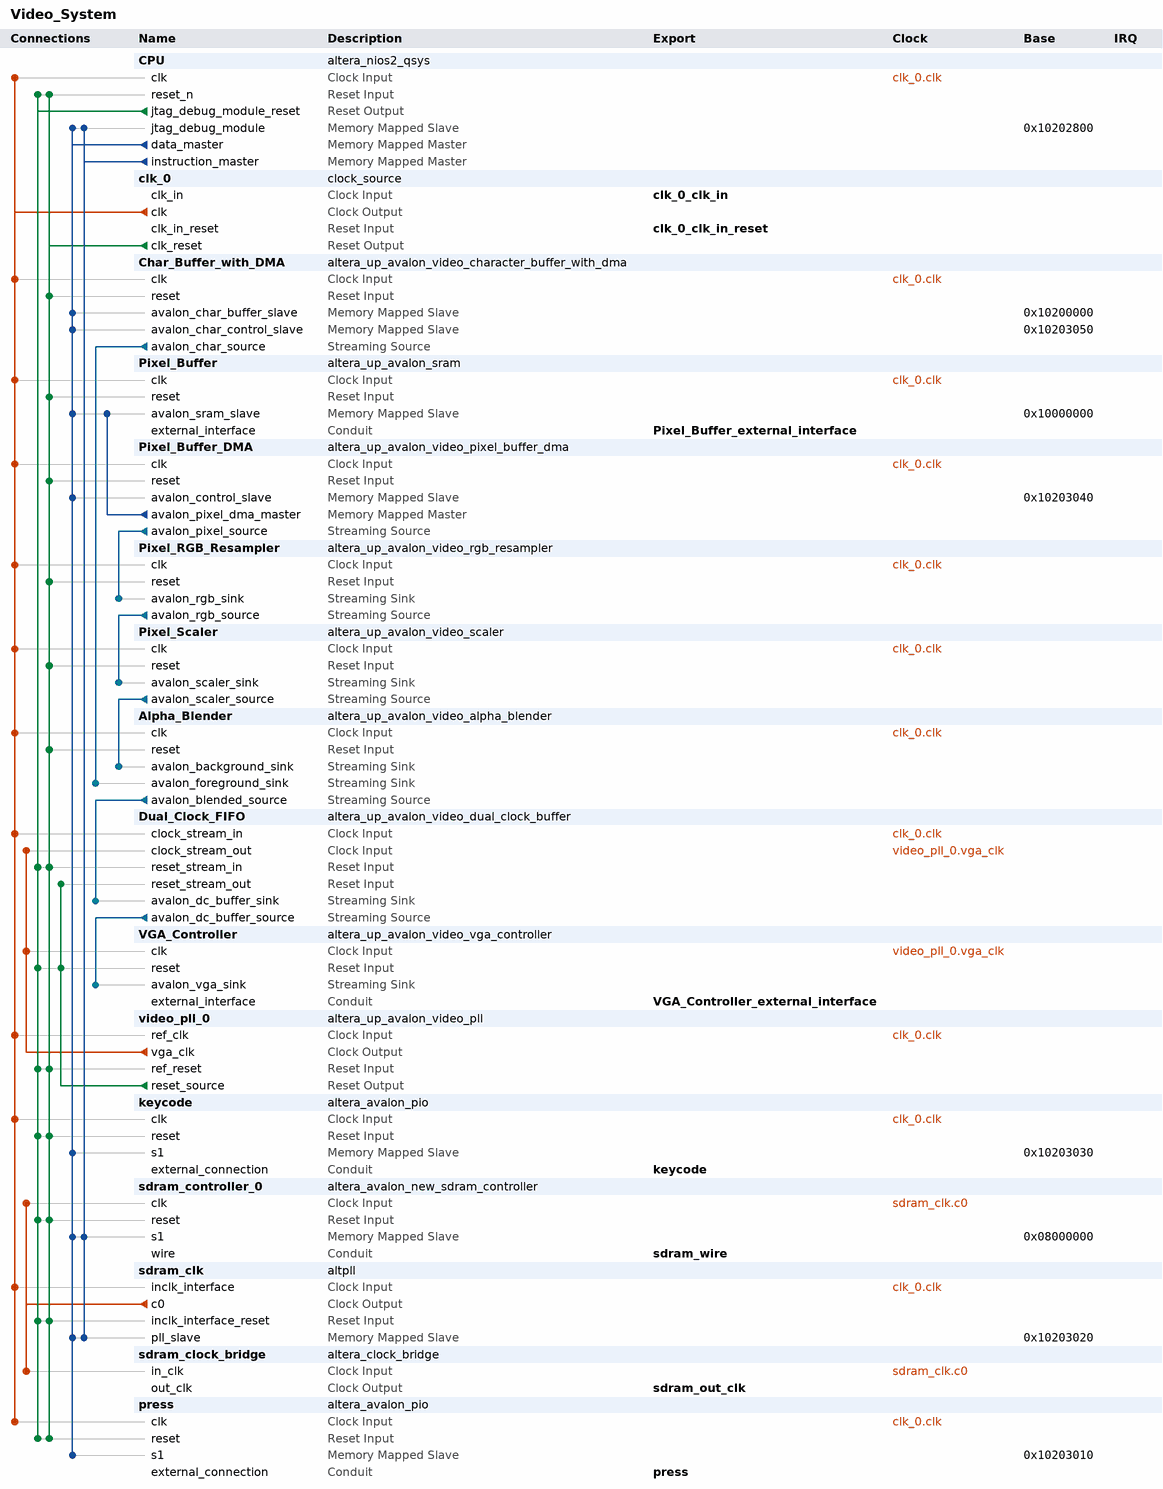
[diagram p0: system contents]
# Platform Designer (Qsys) system Video_System, Cyclone IV E EP4CE115F29C7
# Parameters at their usual value, and those the tool derives, are not listed.
package require -exact qsys 14.0
create_system Video_System
set_project_property DEVICE_FAMILY {Cyclone IV E}
set_project_property DEVICE EP4CE115F29C7

add_instance CPU altera_nios2_qsys 14.0
set_instance_parameter_value CPU manuallyAssignCpuID false
set_instance_parameter_value CPU resetrequest_enabled true
set_instance_parameter_value CPU resetSlave sdram_controller_0.s1
set_instance_parameter_value CPU exceptionSlave sdram_controller_0.s1
set_instance_parameter_value CPU breakSlave CPU.jtag_debug_module
set_instance_parameter_value CPU impl Tiny
set_instance_parameter_value CPU icache_size 4096

add_instance clk_0 clock_source 14.0
set_instance_parameter_value clk_0 clockFrequency 50000000

add_instance Char_Buffer_with_DMA altera_up_avalon_video_character_buffer_with_dma 14.0
set_instance_parameter_value Char_Buffer_with_DMA enable_transparency true

add_instance Pixel_Buffer altera_up_avalon_sram 14.0
set_instance_parameter_value Pixel_Buffer board DE2-115
set_instance_parameter_value Pixel_Buffer pixel_buffer true

add_instance Pixel_Buffer_DMA altera_up_avalon_video_pixel_buffer_dma 14.0
set_instance_parameter_value Pixel_Buffer_DMA addr_mode X-Y
set_instance_parameter_value Pixel_Buffer_DMA start_address 0
set_instance_parameter_value Pixel_Buffer_DMA back_start_address 0
set_instance_parameter_value Pixel_Buffer_DMA image_width 320
set_instance_parameter_value Pixel_Buffer_DMA image_height 240
set_instance_parameter_value Pixel_Buffer_DMA color_space {16-bit RGB}

add_instance Pixel_RGB_Resampler altera_up_avalon_video_rgb_resampler 14.0
set_instance_parameter_value Pixel_RGB_Resampler input_type {16-bit RGB}
set_instance_parameter_value Pixel_RGB_Resampler output_type {30-bit RGB}
set_instance_parameter_value Pixel_RGB_Resampler alpha 255

add_instance Pixel_Scaler altera_up_avalon_video_scaler 14.0
set_instance_parameter_value Pixel_Scaler width_scaling 2
set_instance_parameter_value Pixel_Scaler height_scaling 2
set_instance_parameter_value Pixel_Scaler width_in 320
set_instance_parameter_value Pixel_Scaler color_bits 10
set_instance_parameter_value Pixel_Scaler color_planes 3

add_instance Alpha_Blender altera_up_avalon_video_alpha_blender 14.0

add_instance Dual_Clock_FIFO altera_up_avalon_video_dual_clock_buffer 14.0
set_instance_parameter_value Dual_Clock_FIFO color_bits 10

add_instance VGA_Controller altera_up_avalon_video_vga_controller 14.0
set_instance_parameter_value VGA_Controller board DE2-115
set_instance_parameter_value VGA_Controller resolution {VGA 640x480}

add_instance video_pll_0 altera_up_avalon_video_pll 14.0
set_instance_parameter_value video_pll_0 gui_refclk 50.0
set_instance_parameter_value video_pll_0 camera {5MP Digital Camera}
set_instance_parameter_value video_pll_0 lcd {7" LCD on VEEK-MT and MTL Module}

add_instance keycode altera_avalon_pio 14.0
set_instance_parameter_value keycode direction Input
set_instance_parameter_value keycode width 8

add_instance sdram_controller_0 altera_avalon_new_sdram_controller 14.0
set_instance_parameter_value sdram_controller_0 TAC 5.5
set_instance_parameter_value sdram_controller_0 TRCD 20.0
set_instance_parameter_value sdram_controller_0 TRP 20.0
set_instance_parameter_value sdram_controller_0 casLatency 3
set_instance_parameter_value sdram_controller_0 columnWidth 10
set_instance_parameter_value sdram_controller_0 dataWidth 32
set_instance_parameter_value sdram_controller_0 generateSimulationModel false
set_instance_parameter_value sdram_controller_0 model single_Micron_MT48LC4M32B2_7_chip
set_instance_parameter_value sdram_controller_0 numberOfBanks 4
set_instance_parameter_value sdram_controller_0 numberOfChipSelects 1
set_instance_parameter_value sdram_controller_0 powerUpDelay 200.0
set_instance_parameter_value sdram_controller_0 refreshPeriod 7.8125
set_instance_parameter_value sdram_controller_0 rowWidth 13

add_instance sdram_clk altpll 14.0
set_instance_parameter_value sdram_clk INCLK0_INPUT_FREQUENCY 20000
set_instance_parameter_value sdram_clk CLK0_MULTIPLY_BY 1
set_instance_parameter_value sdram_clk CLK0_DIVIDE_BY 1
set_instance_parameter_value sdram_clk CLK0_PHASE_SHIFT -3000
set_instance_parameter_value sdram_clk PORT_clk1 PORT_UNUSED
set_instance_parameter_value sdram_clk PORT_clk2 PORT_UNUSED
set_instance_parameter_value sdram_clk PORT_clk3 PORT_UNUSED
set_instance_parameter_value sdram_clk PORT_ARESET PORT_UNUSED
set_instance_parameter_value sdram_clk PORT_LOCKED PORT_UNUSED

add_instance sdram_clock_bridge altera_clock_bridge 14.0
set_instance_parameter_value sdram_clock_bridge DERIVED_CLOCK_RATE 50000000
set_instance_parameter_value sdram_clock_bridge EXPLICIT_CLOCK_RATE 0

add_instance press altera_avalon_pio 14.0
set_instance_parameter_value press direction Input
set_instance_parameter_value press width 8

# connections
add_connection clk_0.clk Alpha_Blender.clk clock
add_connection clk_0.clk Char_Buffer_with_DMA.clk clock
add_connection clk_0.clk CPU.clk clock
add_connection clk_0.clk Dual_Clock_FIFO.clock_stream_in clock
add_connection clk_0.clk keycode.clk clock
add_connection clk_0.clk Pixel_Buffer.clk clock
add_connection clk_0.clk Pixel_Buffer_DMA.clk clock
add_connection clk_0.clk Pixel_RGB_Resampler.clk clock
add_connection clk_0.clk Pixel_Scaler.clk clock
add_connection clk_0.clk press.clk clock
add_connection clk_0.clk sdram_clk.inclk_interface clock
add_connection clk_0.clk video_pll_0.ref_clk clock
add_connection sdram_clk.c0 sdram_clock_bridge.in_clk clock
add_connection sdram_clk.c0 sdram_controller_0.clk clock
add_connection video_pll_0.vga_clk Dual_Clock_FIFO.clock_stream_out clock
add_connection video_pll_0.vga_clk VGA_Controller.clk clock
add_connection clk_0.clk_reset Alpha_Blender.reset reset
add_connection clk_0.clk_reset Char_Buffer_with_DMA.reset reset
add_connection clk_0.clk_reset CPU.reset_n reset
add_connection clk_0.clk_reset Dual_Clock_FIFO.reset_stream_in reset
add_connection clk_0.clk_reset keycode.reset reset
add_connection clk_0.clk_reset Pixel_Buffer.reset reset
add_connection clk_0.clk_reset Pixel_Buffer_DMA.reset reset
add_connection clk_0.clk_reset Pixel_RGB_Resampler.reset reset
add_connection clk_0.clk_reset Pixel_Scaler.reset reset
add_connection clk_0.clk_reset press.reset reset
add_connection clk_0.clk_reset sdram_clk.inclk_interface_reset reset
add_connection clk_0.clk_reset sdram_controller_0.reset reset
add_connection clk_0.clk_reset video_pll_0.ref_reset reset
add_connection CPU.jtag_debug_module_reset CPU.reset_n reset
add_connection CPU.jtag_debug_module_reset Dual_Clock_FIFO.reset_stream_in reset
add_connection CPU.jtag_debug_module_reset keycode.reset reset
add_connection CPU.jtag_debug_module_reset press.reset reset
add_connection CPU.jtag_debug_module_reset sdram_clk.inclk_interface_reset reset
add_connection CPU.jtag_debug_module_reset sdram_controller_0.reset reset
add_connection CPU.jtag_debug_module_reset VGA_Controller.reset reset
add_connection CPU.jtag_debug_module_reset video_pll_0.ref_reset reset
add_connection video_pll_0.reset_source Dual_Clock_FIFO.reset_stream_out reset
add_connection video_pll_0.reset_source VGA_Controller.reset reset
add_connection CPU.data_master Char_Buffer_with_DMA.avalon_char_buffer_slave avalon
set_connection_parameter_value CPU.data_master/Char_Buffer_with_DMA.avalon_char_buffer_slave baseAddress 0x10200000
add_connection CPU.data_master Char_Buffer_with_DMA.avalon_char_control_slave avalon
set_connection_parameter_value CPU.data_master/Char_Buffer_with_DMA.avalon_char_control_slave baseAddress 0x10203050
add_connection CPU.data_master CPU.jtag_debug_module avalon
set_connection_parameter_value CPU.data_master/CPU.jtag_debug_module baseAddress 0x10202800
add_connection CPU.data_master keycode.s1 avalon
set_connection_parameter_value CPU.data_master/keycode.s1 baseAddress 0x10203030
add_connection CPU.data_master Pixel_Buffer.avalon_sram_slave avalon
set_connection_parameter_value CPU.data_master/Pixel_Buffer.avalon_sram_slave baseAddress 0x10000000
add_connection CPU.data_master Pixel_Buffer_DMA.avalon_control_slave avalon
set_connection_parameter_value CPU.data_master/Pixel_Buffer_DMA.avalon_control_slave baseAddress 0x10203040
add_connection CPU.data_master press.s1 avalon
set_connection_parameter_value CPU.data_master/press.s1 baseAddress 0x10203010
add_connection CPU.data_master sdram_clk.pll_slave avalon
set_connection_parameter_value CPU.data_master/sdram_clk.pll_slave baseAddress 0x10203020
add_connection CPU.data_master sdram_controller_0.s1 avalon
set_connection_parameter_value CPU.data_master/sdram_controller_0.s1 baseAddress 0x08000000
add_connection CPU.instruction_master CPU.jtag_debug_module avalon
set_connection_parameter_value CPU.instruction_master/CPU.jtag_debug_module baseAddress 0x10202800
add_connection CPU.instruction_master sdram_clk.pll_slave avalon
set_connection_parameter_value CPU.instruction_master/sdram_clk.pll_slave baseAddress 0x10203020
add_connection CPU.instruction_master sdram_controller_0.s1 avalon
set_connection_parameter_value CPU.instruction_master/sdram_controller_0.s1 baseAddress 0x08000000
add_connection Pixel_Buffer_DMA.avalon_pixel_dma_master Pixel_Buffer.avalon_sram_slave avalon
set_connection_parameter_value Pixel_Buffer_DMA.avalon_pixel_dma_master/Pixel_Buffer.avalon_sram_slave baseAddress 0x10000000
add_connection Alpha_Blender.avalon_blended_source Dual_Clock_FIFO.avalon_dc_buffer_sink avalon_streaming
add_connection Char_Buffer_with_DMA.avalon_char_source Alpha_Blender.avalon_foreground_sink avalon_streaming
add_connection Dual_Clock_FIFO.avalon_dc_buffer_source VGA_Controller.avalon_vga_sink avalon_streaming
add_connection Pixel_Buffer_DMA.avalon_pixel_source Pixel_RGB_Resampler.avalon_rgb_sink avalon_streaming
add_connection Pixel_RGB_Resampler.avalon_rgb_source Pixel_Scaler.avalon_scaler_sink avalon_streaming
add_connection Pixel_Scaler.avalon_scaler_source Alpha_Blender.avalon_background_sink avalon_streaming

# exported interfaces
add_interface Pixel_Buffer_external_interface conduit end
set_interface_property Pixel_Buffer_external_interface EXPORT_OF Pixel_Buffer.external_interface
add_interface VGA_Controller_external_interface conduit end
set_interface_property VGA_Controller_external_interface EXPORT_OF VGA_Controller.external_interface
add_interface clk_0_clk_in clock sink
set_interface_property clk_0_clk_in EXPORT_OF clk_0.clk_in
add_interface clk_0_clk_in_reset reset sink
set_interface_property clk_0_clk_in_reset EXPORT_OF clk_0.clk_in_reset
add_interface keycode conduit end
set_interface_property keycode EXPORT_OF keycode.external_connection
add_interface sdram_out_clk clock source
set_interface_property sdram_out_clk EXPORT_OF sdram_clock_bridge.out_clk
add_interface sdram_wire conduit end
set_interface_property sdram_wire EXPORT_OF sdram_controller_0.wire
add_interface press conduit end
set_interface_property press EXPORT_OF press.external_connection

set_interconnect_requirement {$system} qsys_mm.clockCrossingAdapter HANDSHAKE
set_interconnect_requirement {$system} qsys_mm.maxAdditionalLatency 0

save_system Video_System.qsys
